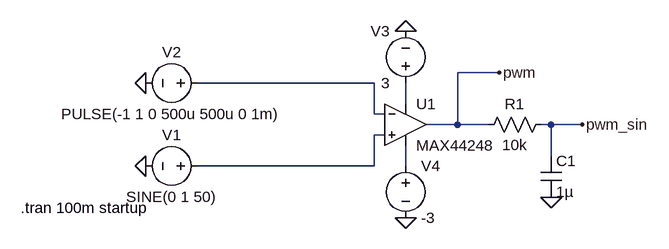
[diagram p0: schematic zad2.asc]
zad2.asc, the LTspice schematic file:
Version 4
SHEET 1 1064 680
WIRE -224 0 -288 0
WIRE -416 16 -688 16
WIRE -368 48 -368 16
WIRE -416 64 -416 16
WIRE -400 64 -416 64
WIRE -288 80 -288 0
WIRE -288 80 -336 80
WIRE -240 80 -288 80
WIRE -144 80 -160 80
WIRE -96 80 -144 80
WIRE -400 96 -416 96
WIRE -144 128 -144 80
WIRE -416 144 -416 96
WIRE -416 144 -688 144
WIRE -368 144 -368 112
FLAG -768 16 0
FLAG -768 144 0
FLAG -224 0 pwm
FLAG -368 -64 0
FLAG -368 224 0
FLAG -96 80 pwm_sin
FLAG -144 192 0
DATAFLAG -464 16 ""
DATAFLAG -448 144 ""
SYMBOL voltage -672 144 R90
WINDOW 0 -32 56 VBottom 2
WINDOW 3 32 56 VTop 2
WINDOW 123 0 0 Left 0
WINDOW 39 0 0 Left 0
SYMATTR InstName V1
SYMATTR Value SINE(0 1 50)
SYMBOL voltage -672 16 R90
WINDOW 0 -32 56 VBottom 2
WINDOW 3 32 56 VTop 2
WINDOW 123 0 0 Left 0
WINDOW 39 0 0 Left 0
SYMATTR InstName V2
SYMATTR Value PULSE(-1 1 0 500u 500u 0 1m)
SYMBOL voltage -368 32 R180
WINDOW 0 24 96 Left 2
WINDOW 3 24 16 Left 2
WINDOW 123 0 0 Left 0
WINDOW 39 0 0 Left 0
SYMATTR InstName V3
SYMATTR Value 3
SYMBOL voltage -368 128 R0
WINDOW 123 0 0 Left 0
WINDOW 39 0 0 Left 0
SYMATTR InstName V4
SYMATTR Value -3
SYMBOL OpAmps\\MAX44248 -368 16 R0
SYMATTR InstName U1
SYMBOL res -144 64 R90
WINDOW 0 0 56 VBottom 2
WINDOW 3 32 56 VTop 2
SYMATTR InstName R1
SYMATTR Value 10k
SYMBOL cap -160 128 R0
SYMATTR InstName C1
SYMATTR Value 1µ
TEXT -960 208 Left 2 !.tran 100m startup

The netlist it stands for:
* zad2.asc
V1 N003 0 SINE(0 1 50)
V2 N001 0 PULSE(-1 1 0 500u 500u 0 1m)
V3 N002 0 3
V4 N004 0 -3
XU1 N003 N001 N002 N004 pwm MAX44248  ; pins In+ In- V+ V- OUT
R1 pwm_sin pwm 10k
C1 pwm_sin 0 1µ
.tran 100m startup
.backanno
.end

* Results of the author's LTspice run, read from the files saved beside the schematic
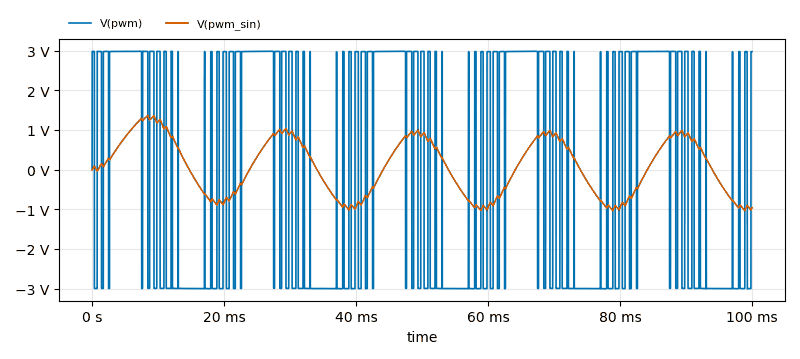
[diagram p1: Transient Analysis of zad2.asc, plotted from the saved traces]
* Transient Analysis, 1 run:
*   V(pwm): min -3.004 V, max 2.983 V, average -24.1 mV, rms 2.976 V, last 2.974 V
*   V(pwm_sin): min -1.035 V, max 1.367 V, average 70.32 mV, rms 702.6 mV, last -954.8 mV